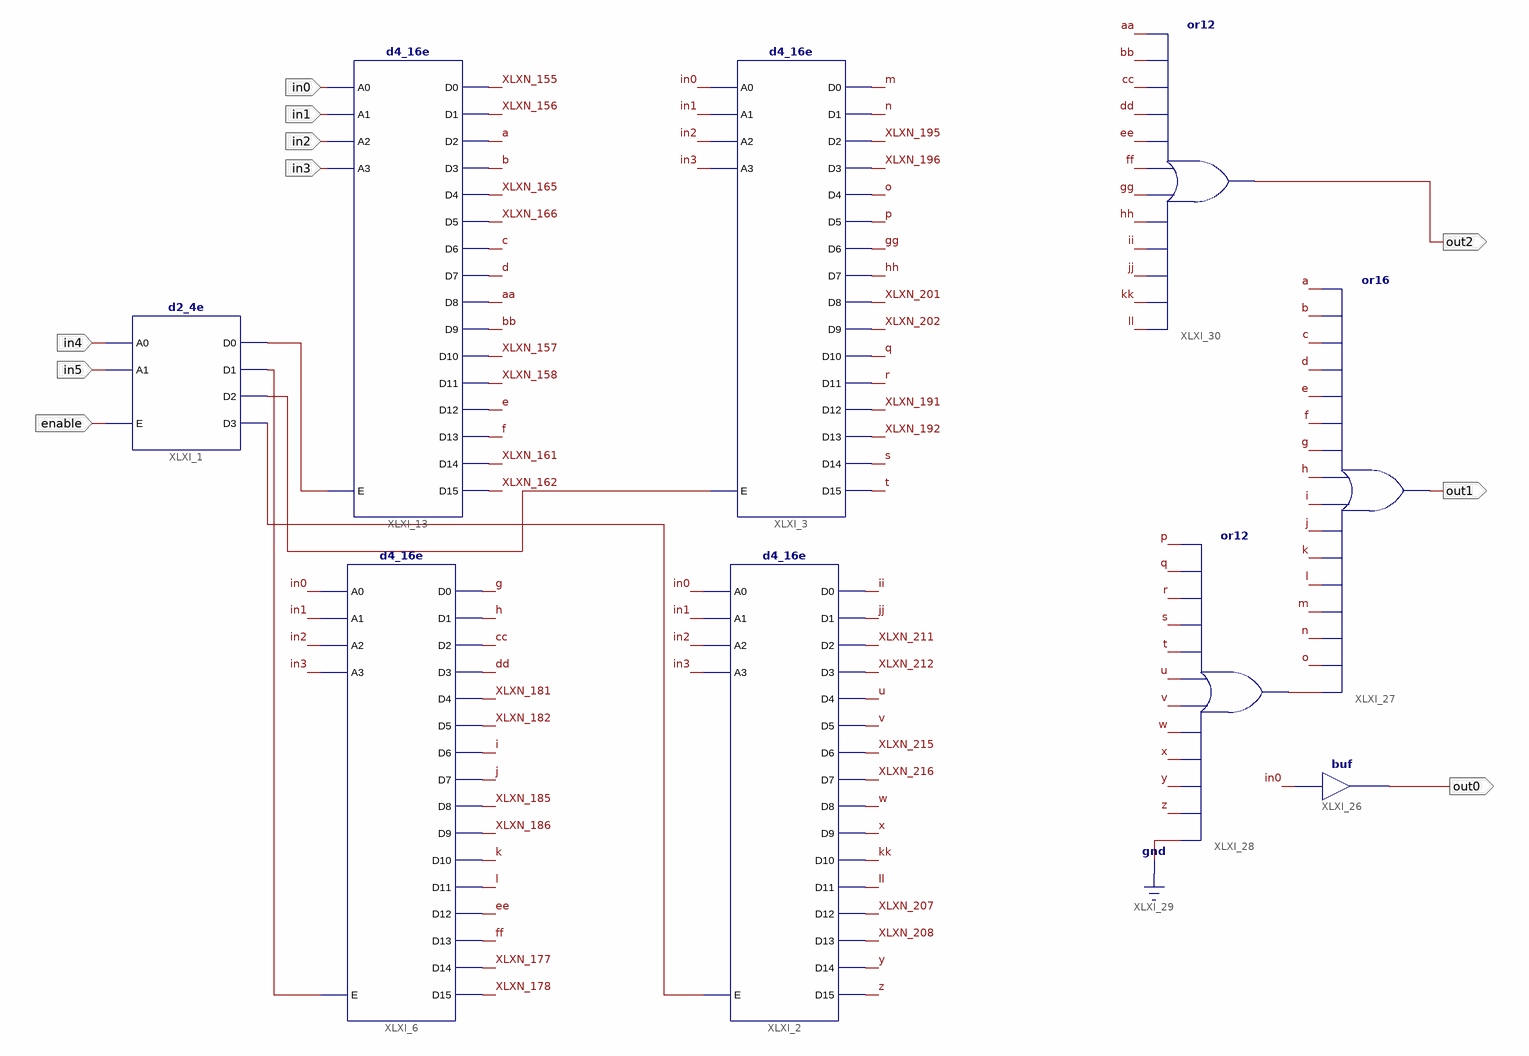
[diagram p0: schematic sheet 1]
// Xilinx ISE schematic Bin_to_Dec_Ones.sch (spartan3e) as structural Verilog: 9 symbols, 10 ports
module Bin_to_Dec_Ones (
  input  enable,
  input  in4,
  input  in5,
  input  in0,
  input  in1,
  input  in2,
  input  in3,
  output out2,
  output out1,
  output out0
);

  wire a, aa, b, bb, c, cc, d, dd, e, ee, f, ff, g, gg, h, hh, i, ii, j, jj, k, kk, l, ll, m, n, o, p, q, r,
       s, t, u, v, w, x, XLXN_1, XLXN_2, XLXN_3, XLXN_9, XLXN_155, XLXN_156, XLXN_157, XLXN_158, XLXN_161,
       XLXN_162, XLXN_165, XLXN_166, XLXN_177, XLXN_178, XLXN_181, XLXN_182, XLXN_185, XLXN_186, XLXN_191,
       XLXN_192, XLXN_195, XLXN_196, XLXN_201, XLXN_202, XLXN_207, XLXN_208, XLXN_211, XLXN_212, XLXN_215,
       XLXN_216, XLXN_224, y, z;

  d2_4e XLXI_1 (.A0(in4), .A1(in5), .E(enable), .D0(XLXN_1), .D1(XLXN_9), .D2(XLXN_3), .D3(XLXN_2));
  d4_16e XLXI_2 (
    .A0(in0), .A1(in1), .A2(in2), .A3(in3), .E(XLXN_2), .D0(ii), .D1(jj), .D10(kk), .D11(ll), .D12(XLXN_207),
    .D13(XLXN_208), .D14(y), .D15(z), .D2(XLXN_211), .D3(XLXN_212), .D4(u), .D5(v), .D6(XLXN_215),
    .D7(XLXN_216), .D8(w), .D9(x));
  d4_16e XLXI_3 (
    .A0(in0), .A1(in1), .A2(in2), .A3(in3), .E(XLXN_3), .D0(m), .D1(n), .D10(q), .D11(r), .D12(XLXN_191),
    .D13(XLXN_192), .D14(s), .D15(t), .D2(XLXN_195), .D3(XLXN_196), .D4(o), .D5(p), .D6(gg), .D7(hh),
    .D8(XLXN_201), .D9(XLXN_202));
  d4_16e XLXI_6 (
    .A0(in0), .A1(in1), .A2(in2), .A3(in3), .E(XLXN_9), .D0(g), .D1(h), .D10(k), .D11(l), .D12(ee), .D13(ff),
    .D14(XLXN_177), .D15(XLXN_178), .D2(cc), .D3(dd), .D4(XLXN_181), .D5(XLXN_182), .D6(i), .D7(j),
    .D8(XLXN_185), .D9(XLXN_186));
  d4_16e XLXI_13 (
    .A0(in0), .A1(in1), .A2(in2), .A3(in3), .E(XLXN_1), .D0(XLXN_155), .D1(XLXN_156), .D10(XLXN_157),
    .D11(XLXN_158), .D12(e), .D13(f), .D14(XLXN_161), .D15(XLXN_162), .D2(a), .D3(b), .D4(XLXN_165),
    .D5(XLXN_166), .D6(c), .D7(d), .D8(aa), .D9(bb));
  buf XLXI_26 (out0, in0);
  or XLXI_27 (out1, XLXN_224, o, n, m, l, k, j, i, h, g, f, e, d, c, b, a);
  or XLXI_28 (XLXN_224, 1'b0, z, y, x, w, v, u, t, s, r, q, p);
  or XLXI_30 (out2, ll, kk, jj, ii, hh, gg, ff, ee, dd, cc, bb, aa);
endmodule
